# Altium project ScoreBoard_v.1.0.PrjPcb
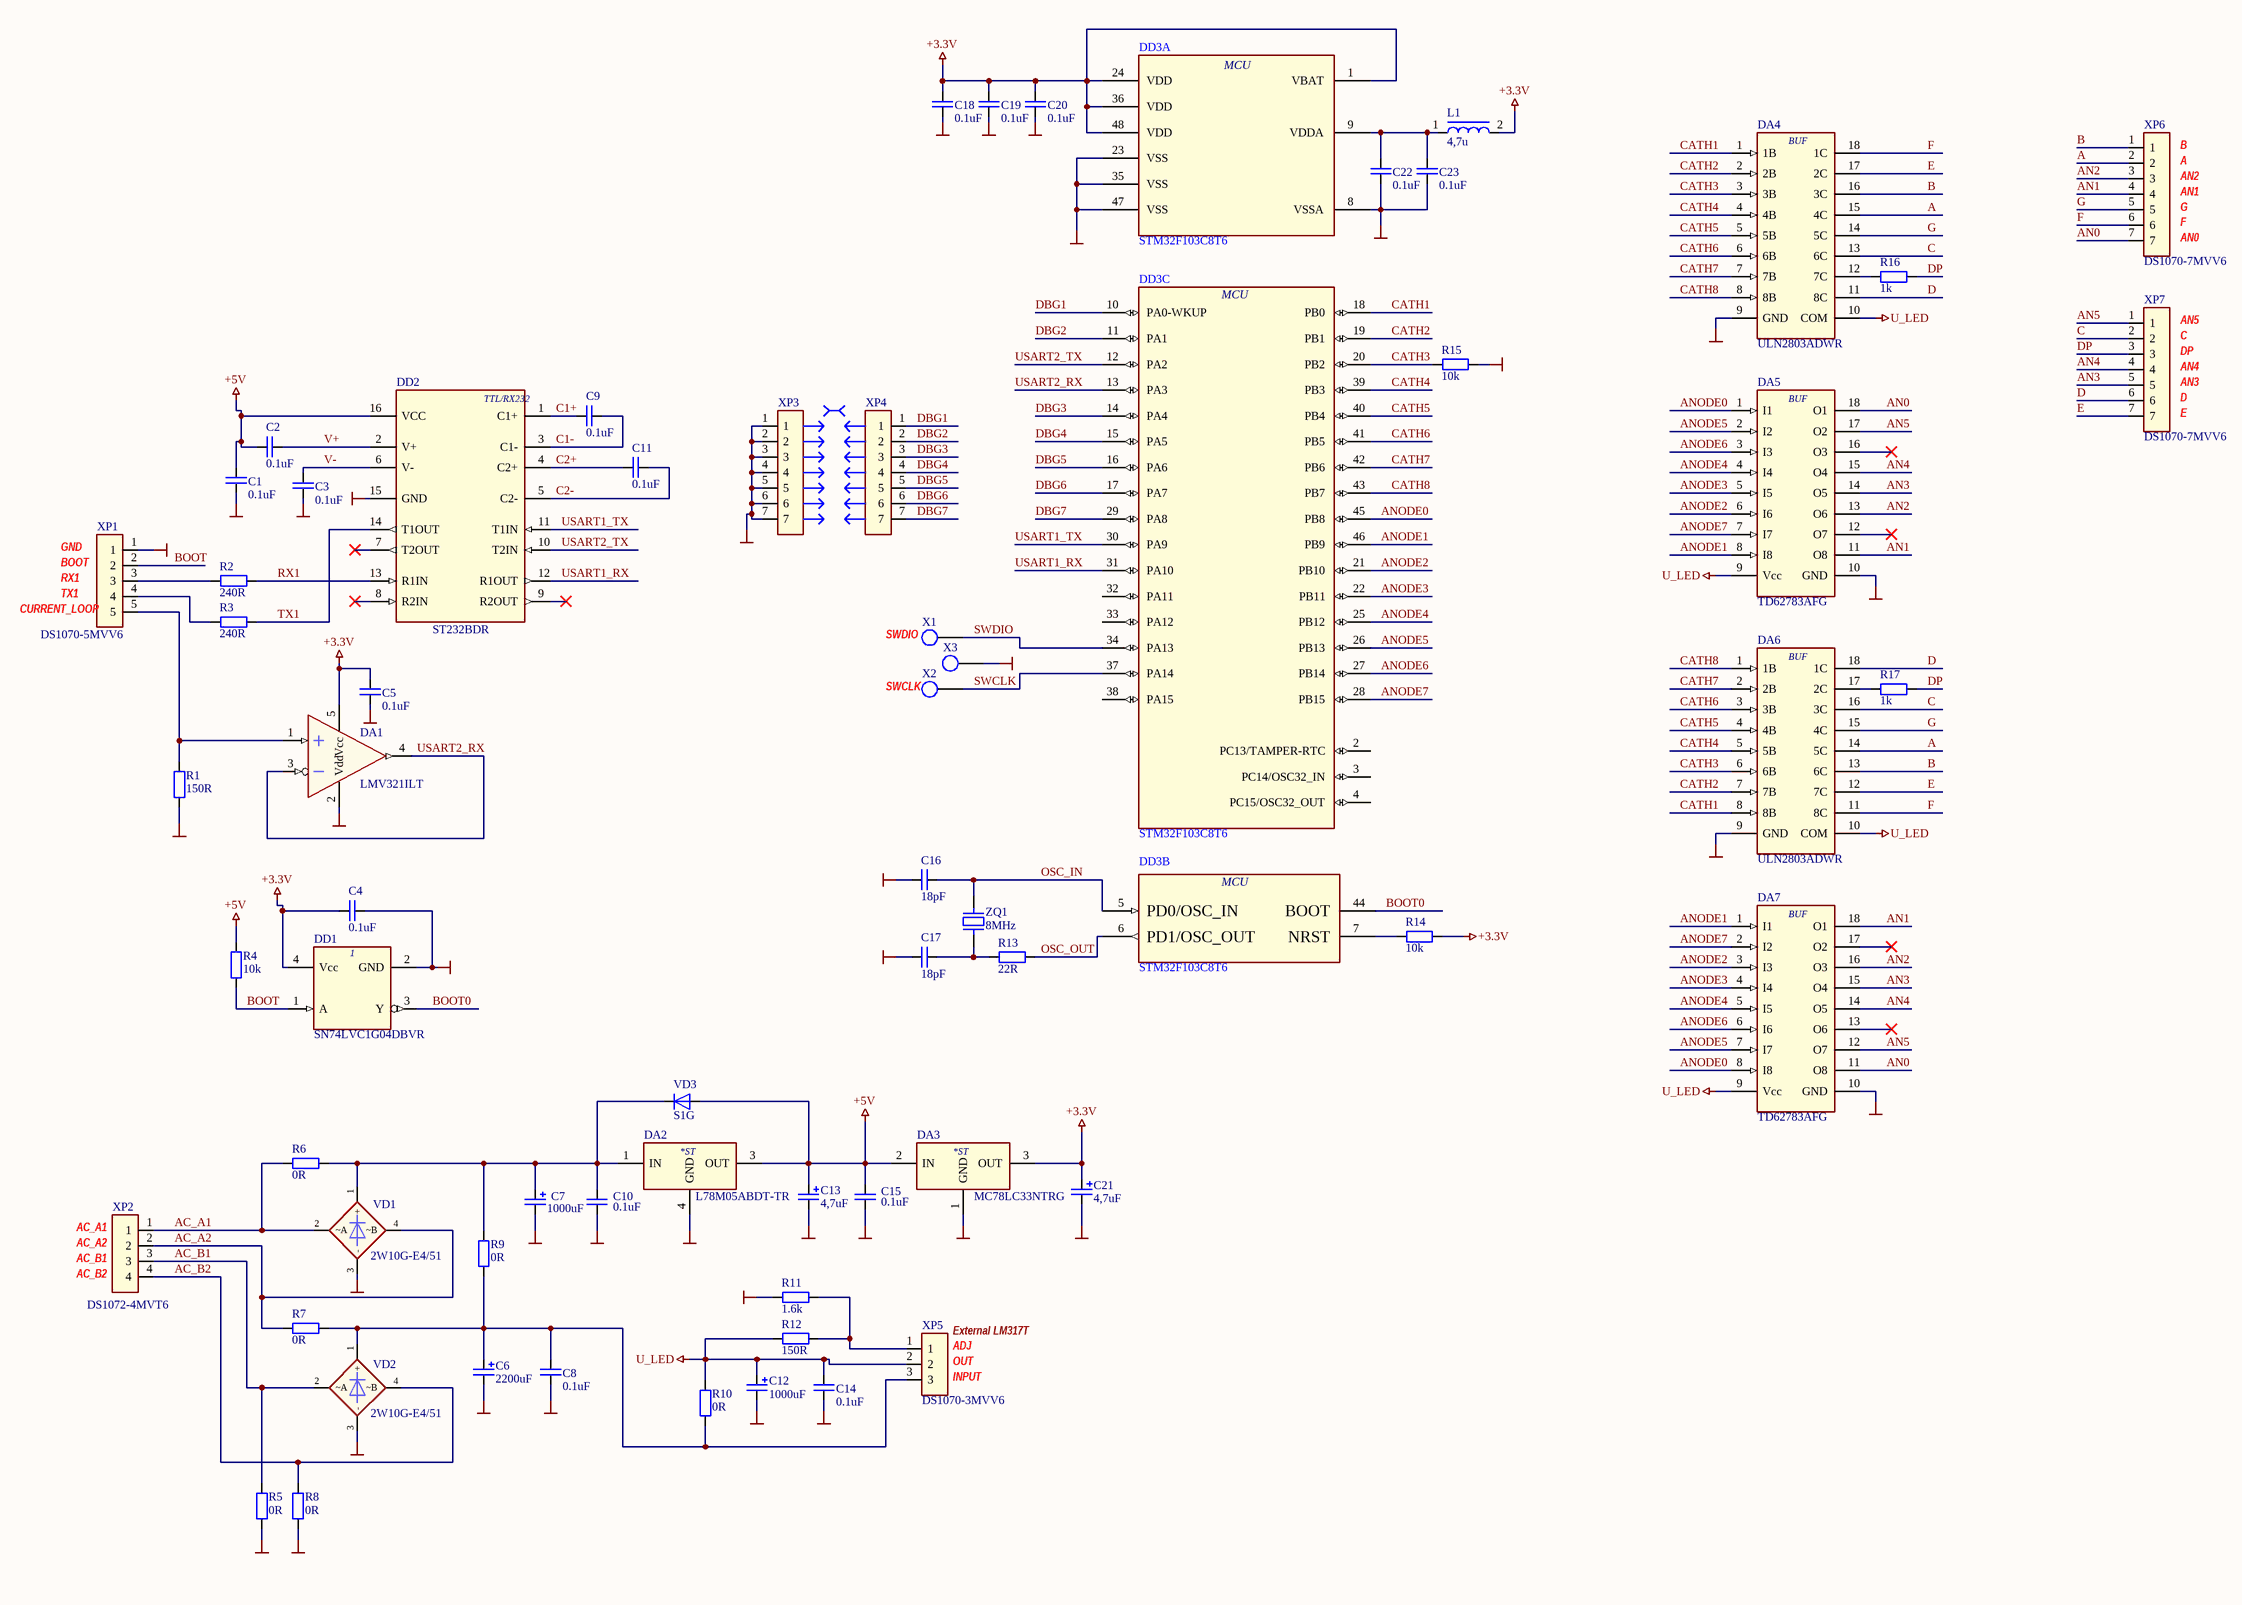
[diagram p0: SB_MAIN.SchDoc]
1 sheet, 65 parts. Net scope: global (net labels, ports and power ports of the same name join across sheets).

## Sheet SB_MAIN.SchDoc
size A2; SheetNumber: 1; SheetTotal: 1

### Parts
C1  0.1uF  [CAPC2012X14N]
C2  0.1uF  [CAPC2012X14N]
C3  0.1uF  [CAPC2012X14N]
C4  0.1uF  [CAPC2012X14N]
C5  0.1uF  [CAPC2012X14N]
C6  2200uF  [CAPR16X25]
C7  1000uF  [CAPR10x21]
C8  0.1uF  [JFA11x13x7.5]
C9  0.1uF  [CAPC2012X14N]
C10  0.1uF  [JFA11x13x7.5]
C11  0.1uF  [CAPC2012X14N]
C12  1000uF  [CAPR10x21]
C13  4,7uF  [CAPMP3217X18N]
C14  0.1uF  [JFA11x13x7.5]
C15  0.1uF  [JFA11x13x7.5]
C16  18pF  [CAPC2012X14N]
C17  18pF  [CAPC2012X14N]
C18  0.1uF  [CAPC2012X14N]
C19  0.1uF  [CAPC2012X14N]
C20  0.1uF  [CAPC2012X14N]
C21  4,7uF  [CAPMP3217X18N]
C22  0.1uF  [CAPC2012X14N]
C23  0.1uF  [CAPC2012X14N]
DA1  LMV321ILT  [SOT95P280X145-5N]
DA2  L78M05ABDT-TR  [DPAK228P1010X238-3N]
DA3  MC78LC33NTRG  [SOT89-150P350X160-3M]
DA4  ULN2803ADWR  [SOIC127P1030X265-18N]
DA5  TD62783AFG  [SOIC127P1020X245-18N]
DA6  ULN2803ADWR  [SOIC127P1030X265-18N]
DA7  TD62783AFG  [SOIC127P1020X245-18N]
DD1  SN74LVC1G04DBVR  [SOT95P280X145-5N]
DD2  ST232BDR  [SOIC127P600X175-16N]
DD3  STM32F103C8T6  [TSQFP50P900X900X160-48M]  (parts A,B,C of 3)
L1  4,7u  [INDC2012X10N]
R1  150R  [RESC2012X06N]
R2  240R  [RESC2012X06N]
R3  240R  [RESC2012X06N]
R4  10k  [RESC2012X06N]
R5  0R  [RESC6332X06N]
R6  0R  [RESC6332X06N]
R7  0R  [RESC6332X06N]
R8  0R  [RESC6332X06N]
R9  0R  [RESC6332X06N]
R10  0R  [RESC6332X06N]
R11  1.6k  [RESC2012X06N]
R12  150R  [RESC2012X06N]
R13  22R  [RESC2012X06N]
R14  10k  [RESC2012X06N]
R15  10k  [RESC2012X06N]
R16  1k  [RESC2012X06N]
R17  1k  [RESC2012X06N]
VD1  2W10G-E4/51  [DIOB_2W10]
VD2  2W10G-E4/51  [DIOB_2W10]
VD3  S1G  [DIOM4427X22M]
X1  0,9mm  [PAD_HOLE_0.9MM]  (value not drawn)  (no BOM)
X2  0,9mm  [PAD_HOLE_0.9MM]  (value not drawn)  (no BOM)
X3  0,9mm  [PAD_HOLE_0.9MM]  (value not drawn)  (no BOM)
XP1  DS1070-5MVV6  [CONNFLY_DS1070-5MVV6]
XP2  DS1072-4MVT6  [CONNFLY_DS1072-4MVT6]
XP3  L-KLS1-207-1-07-S  [KLS_KLS1-207-1-07-S]  (value not drawn)
XP4  L-KLS1-207-1-07-S  [KLS_KLS1-207-1-07-S]  (value not drawn)
XP5  DS1070-3MVV6  [CONNFLY_DS1070-3MVV6]
XP6  DS1070-7MVV6  [CONNFLY_DS1070-7MVV6]
XP7  DS1070-7MVV6  [CONNFLY_DS1070-7MVV6]
ZQ1  8MHz  [KX-3H_spacer]

### Nets
+3.3V: C4.1 C5.2 C18.2 C19.2 C20.2 C21.1(P) DA1.5(Vcc) DA3.3(OUT) DD1.4(Vcc) DD3.1(VBAT) DD3.24(VDD) DD3.36(VDD) DD3.48(VDD) L1.2 R14.2
+5V: C1.2 C2.1 C13.1(P) C15.2 DA2.3(OUT) DA3.2(IN) DD2.16(VCC) R4.2 VD3.2(A)
GND: C1.1 C3.2 C4.2 C5.1 C6.2(N) C7.2(N) C8.1 C10.1 C12.2(N) C13.2(N) C14.1 C15.1 C16.1 C17.1 C18.1 C19.1 C20.1 C21.2(N) C22.1 C23.1 DA1.2(Vdd) DA2.4(GND) DA3.1(GND) DA4.9(GND) DA5.10(GND) DA6.9(GND) DA7.10(GND) DD1.2(GND) DD2.15(GND) DD3.8(VSSA) DD3.23(VSS) DD3.35(VSS) DD3.47(VSS) R1.1 R5.1 R8.1 R11.1 R15.2 VD1.3(-) VD2.3(-) X3.1 XP1.1 XP3.1 XP3.2 XP3.3 XP3.4 XP3.5 XP3.6 XP3.7
U_LED: C12.1(P) C14.2 DA4.10(COM) DA5.9(Vcc) DA6.10(COM) DA7.9(Vcc) R10.2 R12.1 XP5.2
A: DA4.15(4C) DA6.14(5C) XP6.2
AC_A1: R6.1 VD1.2(~A) XP2.1
AC_A2: R7.1 VD1.4(~B) XP2.2
AC_B1: R5.2 VD2.2(~A) XP2.3
AC_B2: R8.2 VD2.4(~B) XP2.4
AN0: DA5.18(O1) DA7.11(O8) XP6.7
AN1: DA5.11(O8) DA7.18(O1) XP6.4
AN2: DA5.13(O6) DA7.16(O3) XP6.3
AN3: DA5.14(O5) DA7.15(O4) XP7.5
AN4: DA5.15(O4) DA7.14(O5) XP7.4
AN5: DA5.17(O2) DA7.12(O7) XP7.1
ANODE0: DA5.1(I1) DA7.8(I8) DD3.45(PB8)
ANODE1: DA5.8(I8) DA7.1(I1) DD3.46(PB9)
ANODE2: DA5.6(I6) DA7.3(I3) DD3.21(PB10)
ANODE3: DA5.5(I5) DA7.4(I4) DD3.22(PB11)
ANODE4: DA5.4(I4) DA7.5(I5) DD3.25(PB12)
ANODE5: DA5.2(I2) DA7.7(I7) DD3.26(PB13)
ANODE6: DA5.3(I3) DA7.6(I6) DD3.27(PB14)
ANODE7: DA5.7(I7) DA7.2(I2) DD3.28(PB15)
B: DA4.16(3C) DA6.13(6C) XP6.1
BOOT: DD1.1(A) R4.1 XP1.2
BOOT0: DD1.3(Y) DD3.44(BOOT)
C: DA4.13(6C) DA6.16(3C) XP7.2
C1+: C9.2 DD2.1(C1+)
C1-: C9.1 DD2.3(C1-)
C2+: C11.2 DD2.4(C2+)
C2-: C11.1 DD2.5(C2-)
CATH1: DA4.1(1B) DA6.8(8B) DD3.18(PB0)
CATH2: DA4.2(2B) DA6.7(7B) DD3.19(PB1)
CATH3: DA4.3(3B) DA6.6(6B) DD3.20(PB2) R15.1
CATH4: DA4.4(4B) DA6.5(5B) DD3.39(PB3)
CATH5: DA4.5(5B) DA6.4(4B) DD3.40(PB4)
CATH6: DA4.6(6B) DA6.3(3B) DD3.41(PB5)
CATH7: DA4.7(7B) DA6.2(2B) DD3.42(PB6)
CATH8: DA4.8(8B) DA6.1(1B) DD3.43(PB7)
D: DA4.11(8C) DA6.18(1C) XP7.6
DBG1: DD3.10(PA0-WKUP) XP4.1
DBG2: DD3.11(PA1) XP4.2
DBG3: DD3.14(PA4) XP4.3
DBG4: DD3.15(PA5) XP4.4
DBG5: DD3.16(PA6) XP4.5
DBG6: DD3.17(PA7) XP4.6
DBG7: DD3.29(PA8) XP4.7
DP: R16.2 R17.2 XP7.3
E: DA4.17(2C) DA6.12(7C) XP7.7
F: DA4.18(1C) DA6.11(8C) XP6.6
G: DA4.14(5C) DA6.15(4C) XP6.5
OSC_IN: C16.2 DD3.5(PD0/OSC_IN) ZQ1.2
OSC_OUT: DD3.6(PD1/OSC_OUT) R13.2
RX1: DD2.13(R1IN) R2.2
SWCLK: DD3.37(PA14) X2.1
SWDIO: DD3.34(PA13) X1.1
TX1: DD2.14(T1OUT) R3.2
USART1_RX: DD2.12(R1OUT) DD3.31(PA10)
USART1_TX: DD2.11(T1IN) DD3.30(PA9)
USART2_RX: DA1.3(-IN) DA1.4(OUT) DD3.13(PA3)
USART2_TX: DD2.10(T2IN) DD3.12(PA2)
V+: C2.2 DD2.2(V+)
V-: C3.1 DD2.6(V-)
NetC6_1: C6.1(P) C8.2 R7.2 R9.1 R10.1 VD2.1(+) XP5.3
NetC7_1: C7.1(P) C10.2 DA2.1(IN) R6.2 R9.2 VD1.1(+) VD3.1(K)
NetC17_2: C17.2 R13.1 ZQ1.1
NetC22_2: C22.2 C23.2 DD3.9(VDDA) L1.1
NetDA1_1: DA1.1(+IN) R1.2 XP1.5
NetDA4_12: DA4.12(7C) R16.1
NetDA6_17: DA6.17(2C) R17.1
NetDD3_7: DD3.7(NRST) R14.1
NetR2_1: R2.1 XP1.3
NetR3_1: R3.1 XP1.4
NetR11_2: R11.2 R12.2 XP5.1

Not connected (* = marked no-connect by the designer): DA5 12(O7)* 16(O3)*; DA7 13(O6)* 17(O2)*; DD2 7(T2OUT)* 8(R2IN)* 9(R2OUT)*; DD3 2(PC13/TAMPER-RTC) 3(PC14/OSC32_IN) 4(PC15/OSC32_OUT) 32(PA11) 33(PA12) 38(PA15)

### Notes on the sheet
- (near XP6) B
- (near XP6) A
- (near XP6) AN2
- (near XP6) AN1
- (near XP6) G
- (near XP6) F
- (near XP6) AN0
- (near XP7) AN5
- (near XP7) C
- (near XP7) DP
- (near XP7) AN4
- (near XP7) AN3
- (near XP7) D
- (near XP7) E
- (near XP1) GND
- (near XP1) CURRENT_LOOP
- (near XP1) BOOT
- (near XP1) RX1
- (near XP1) TX1
- (near X1) SWDIO
- (near X2) SWCLK
- (near XP2) AC_A1
- (near XP2) AC_A2
- (near XP2) AC_B1
- (near XP2) AC_B2
- (near XP5) External LM317T
- (near XP5) OUT
- (near XP5) INPUT
- (near XP5) ADJ
- (in symbol L78M05ABDT-TR[[/\]]IPC Medium) *ST
- (in symbol MC78LC33NTRG[[/\]]IPC Medium) *ST
- (in symbol ST232BDR[[/\]]IPC Medium) TTL/RX232
- (in symbol STM32F103C8T6[[/\]]IPC Medium, part A) MCU
- (in symbol STM32F103C8T6[[/\]]IPC Medium, part B) MCU
- (in symbol STM32F103C8T6[[/\]]IPC Medium, part C) MCU
- (in symbol TD62783AFG[[/\]]IPC Medium) BUF
- (in symbol ULN2803ADWR[[/\]]IPC Medium) BUF

### Library data of the parts
C1-C5 C9 C11 C18-C20 C22 C23 = GRM21BR71H104KA01L[[/\]]IPC Medium: Конденсатор 0805-X7R-50В-0,1мкФ ± 10%; Manufacturer: Murata Electronics; Type: Capacitor; Group: Capacitors; Dielectric type: X7R; Nominal Voltage: 50V; Manufacturer Part Number: GRM21BR71H104KA01L; Footprint Density: IPC Medium; Value: 0.1uF; Device Package: 0805; Tolerance: ± 10%; Max Operating Temperature: 125℃; Min Operating Temperature: -55℃
C6 = TKR222M1VK25[[/\]]IPC Medium: Конденсатор электролитический 35В-2200мкФ ± 20%; Manufacturer: Jamicon; Type: Capacitor; Group: Capacitors; Nominal Voltage: 35V; AEQ: No; Ripple Current: 1,6A; Manufacturer Part Number: TKR222M1VK25; Footprint Density: IPC Medium; Value: 2200uF; Device Package: Radial 16x25; Tolerance: ± 20%; Max Operating Temperature: 105℃; Min Operating Temperature: -55℃; RoHS: Yes
C7 C12 = WLR102M1EG21[[/\]]IPC Medium: Конденсатор электролитический 25В-1000мкФ ± 20%; Manufacturer: Jamicon; Type: Capacitor; Group: Capacitors; ESR: 40mOhm; Nominal Voltage: 25V; AEQ: No; Ripple Current: 2,27A; Manufacturer Part Number: WLR102M1EG21; Footprint Density: IPC Medium; Value: 1000uF; Device Package: Radial 10x21; Tolerance: ± 20%; Max Operating Temperature: 105℃; Min Operating Temperature: -55℃; RoHS: Yes
C8 C10 C14 C15 = JFA02A104J075000B[[/\]]IPC Medium: Конденсатор-100В-0,1мкФ ± 5%; Manufacturer: JB; Type: Film Capacitor; Group: Capacitors; Tolerance: ± 10%; ESR: 0,04Ohm; Nominal Voltage: 25V; AEQ: No; Manufacturer Part Number: JFA02A104J075000B; Footprint Density: IPC Medium; Value: 0.1uF; Device Package: Radial 10x21; Max Operating Temperature: 85℃; Min Operating Temperature: -40℃; ComponentLink1URL: https://www.jbcapacitors.com/news/jb-Stock-Offer-for-JFA-Mylar-Polyester-Film-Capacitors-20200227.html; ComponentLink1Description: Datasheet; RoHS: No
C13 C21 = TECAP4,7/10VA10[[/\]]IPC Medium: Конденсатор танталовый 10В-4,7мкФ ± 10%; Manufacturer: NoName; Type: Tantalum Capacitor; Group: Capacitors; Nominal Voltage: 10V; AEQ: No; Manufacturer Part Number: TECAP4,7/10VA10; Footprint Density: IPC Medium; Value: 4,7uF; Device Package: Type A; Tolerance: ± 10%; Max Operating Temperature: 85℃; Min Operating Temperature: -55℃; RoHS: Yes
C16 C17 = GRM2165C1H180JD01D[[/\]]IPC Medium: Конденсатор 0805-C0G-50В-18пФ ± 5%; Manufacturer: Murata Electronics; Type: Capacitor; Group: Capacitors; Dielectric type: C0G; Nominal Voltage: 50V; AEQ: AEC-Q200; Manufacturer Part Number: GRM2165C1H180JD01D; Footprint Density: IPC Medium; Value: 18pF; Device Package: 0805; Tolerance: ± 5%; Max Operating Temperature: 125℃; Min Operating Temperature: -55℃; RoHS: Yes
DA1 = LMV321ILT[[/\]]IPC Medium: Микросхема LMV321ILT; Manufacturer: STMicroelectronics; Group: Integrity circuits; Supply Voltage: 2,7-6V; Supply Current: 200uA; AEQ: No; Gain bandwidth: 1MHz; Input offset voltage: 0,1-3mV; CMRR: 55dB; Slew rate: 0,35V/us; Manufacturer Part Number: LMV321ILT; Footprint Density: IPC Medium; Type: Operational amplifier; Device Package: SOT23-5; Max Operating Temperature: 125℃; Min Operating Temperature: -40℃; RoHS: Yes
DA2 = L78M05ABDT-TR[[/\]]IPC Medium: Микросхема L78M05ABDT-TR; Manufacturer: STMicroelectronics; Group: Integrity circuits; Input Voltage: 35V; Output Voltage: 5V; AEQ: No; Output Current: 350mA; Dropout Voltage: 2V; Manufacturer Part Number: L78M05ABDT-TR; Footprint Density: IPC Medium; Type: Linear regulator; Device Package: DPAK; Max Operating Temperature: 125℃; Min Operating Temperature: -40℃; RoHS: Yes
DA3 = MC78LC33NTRG[[/\]]IPC Medium: Микросхема MC78LC33NTRG; Manufacturer: ON Semiconductor; Group: Integrity circuits; Input Voltage: 12V; Output Voltage: 3,3V; AEQ: No; Output Current: 50mA; Dropout Voltage: 1V; Manufacturer Part Number: MC78LC33NTRG; Footprint Density: IPC Medium; Type: Linear regulator; Device Package: SOT23-5; Max Operating Temperature: 85℃; Min Operating Temperature: -40℃; RoHS: Yes
DA4 DA6 = ULN2803ADWR[[/\]]IPC Medium: Микросхема ULN2803ADWR; Manufacturer: Texas Instruments; Group: Integrity circuits; Supply Voltage: 50V; Supply Current: 1,35mA; AEQ: No; Output Current: 300mA; Input Voltage: 3V; Manufacturer Part Number: ULN2803ADWR; Footprint Density: IPC Medium; Type: 8CH Darlington Transistor Arrays / Current Transistor Array; Device Package: SOIC-18; Max Operating Temperature: 85℃; Min Operating Temperature: -40℃; RoHS: Yes; Output Voltage: 50V
DA5 DA7 = TD62783AFG[[/\]]IPC Medium: Микросхема TD62783AFG; Manufacturer: Toshiba; Group: Integrity circuits; Supply Voltage: 50V; Supply Current: 2,5mA; AEQ: No; Output Current: -500mA; Input Voltage: 2V; Power Dissipation: 0,35W; Manufacturer Part Number: TD62783AFG; Footprint Density: IPC Medium; Type: 8CH HIGH−VOLTAGE SOURCE DRIVER / Current Transistor Array; Device Package: SOP-18; Max Operating Temperature: 85℃; Min Operating Temperature: -40℃; RoHS: Yes; Output Voltage: 50V
DD1 = SN74LVC1G04DBVR[[/\]]IPC Medium: Микросхема SN74LVC1G04DBVR; Manufacturer: Texas Instruments; Group: Integrity circuits; Supply Voltage: 5,5V; Supply Current: 10uA; AEQ: No; Manufacturer Part Number: SN74LVC1G04DBVR; Footprint Density: IPC Medium; Type: Single inverter gate; Device Package: SOT23-5; Max Operating Temperature: 85℃; Min Operating Temperature: -40℃; RoHS: Yes
DD2 = ST232BDR[[/\]]IPC Medium: Микросхема ST232BDR; Manufacturer: STMicroelectronics; Group: Integrity circuits; Supply Voltage: 5,5V; Supply no Load Current: 10mA; AEQ: No; Input Voltage: ± 30V; Output Voltage: ± 7.8V; Date rate: 220 kbits/s; Manufacturer Part Number: ST232BDR; Footprint Density: IPC Medium; Type: RS232 Transmitter; Device Package: SO-16; Max Operating Temperature: 85℃; Min Operating Temperature: -40℃; RoHS: Yes
DD3 = STM32F103C8T6[[/\]]IPC Medium: Микросхема STM32F103C8T6; Manufacturer: STMicroelectronics; Group: Integrity circuits; Supply Voltage: 3,3V; Supply Current: 35mA; AEQ: No; Manufacturer Part Number: STM32F103C8T6; Footprint Density: IPC Medium; Type: Microcontroller; Device Package: LQFP48; Max Operating Temperature: 85℃; Min Operating Temperature: -40℃; RoHS: Yes
L1 = LQM21PN4R7NGR[[/\]]IPC Medium: Индуктивность 0805-4,7мкГ ± 30%; Manufacturer: Murata Electronics; Group: Inductors; AEQ: No; DC Resistance: 0,23mOhm; SRfreq: 30MHz; Rated current 85C: 0,8A; Manufacturer Part Number: LQM21PN4R7NGR; Footprint Density: IPC Medium; Value: 4,7u; Type: Inductor; Device Package: 0805; Tolerance: ± 30%; Max Operating Temperature: 125℃; Min Operating Temperature: -55℃; RoHS: Yes
R1 R12 = RC0805FR-07150RL[[/\]]IPC Medium: Резистор 0805-0,125Вт-150Ом ± 1%; Manufacturer: Yageo; Group: Resistors; Power (Watts): 0,125W; Nominal Voltage: 150V; Max Voltage: 300V; AEQ: No; Manufacturer Part Number: RC0805FR-07150RL; Footprint Density: IPC Medium; Value: 150R; Type: Resistor; Device Package: 0805; Tolerance: ± 1%; Max Operating Temperature: 155℃; Min Operating Temperature: -55℃; RoHS: Yes
R2 R3 = RC0805FR-07240RL[[/\]]IPC Medium: Резистор 0805-0,125Вт-240Ом ± 1%; Manufacturer: Yageo; Group: Resistors; Power (Watts): 0,125W; Nominal Voltage: 150V; Max Voltage: 300V; AEQ: No; Manufacturer Part Number: RC0805FR-07240RL; Footprint Density: IPC Medium; Value: 240R; Type: Resistor; Device Package: 0805; Tolerance: ± 1%; Max Operating Temperature: 155℃; Min Operating Temperature: -55℃; RoHS: Yes
R4 R14 R15 = RC0805FR-0710KL[[/\]]IPC Medium: Резистор 0805-0,125Вт-10кОм ± 1%; Manufacturer: Yageo; Group: Resistors; Power (Watts): 0,125W; Nominal Voltage: 150V; Max Voltage: 300V; AEQ: No; Manufacturer Part Number: RC0805FR-0710KL; Footprint Density: IPC Medium; Value: 10k; Type: Resistor; Device Package: 0805; Tolerance: ± 1%; Max Operating Temperature: 155℃; Min Operating Temperature: -55℃; RoHS: Yes
R5-R10 = RC2512FR-070RL[[/\]]IPC Medium: Резистор 2512-1Вт-0Ом ± 1%; Manufacturer: Yageo; Group: Resistors; Power (Watts): 1W - 4A; Nominal Voltage: 250V; Max Voltage: 500V; AEQ: No; Manufacturer Part Number: RC2512FR-070RL; Footprint Density: IPC Medium; Value: 0R; Type: Resistor; Device Package: 0805; Tolerance: ± 1%; Max Operating Temperature: 155℃; Min Operating Temperature: -55℃; RoHS: Yes
R11 = RC0805FR-071K6L[[/\]]IPC Medium: Резистор 0805-0,125Вт-1,6кОм ± 1%; Manufacturer: Yageo; Group: Resistors; Power (Watts): 0,125W; Nominal Voltage: 150V; Max Voltage: 300V; AEQ: No; Manufacturer Part Number: RC0805FR-071K6L; Footprint Density: IPC Medium; Value: 1.6k; Type: Resistor; Device Package: 0805; Tolerance: ± 1%; Max Operating Temperature: 155℃; Min Operating Temperature: -55℃; RoHS: Yes
R13 = RC0805JR-0722RL[[/\]]IPC Medium: Резистор 0805-0,125Вт-22Ом ± 5%; Manufacturer: Yageo; Group: Resistors; Power (Watts): 0,125W; Nominal Voltage: 150V; Max Voltage: 300V; AEQ: No; Manufacturer Part Number: RC0805JR-0722RL; Footprint Density: IPC Medium; Value: 22R; Type: Resistor; Device Package: 0805; Tolerance: ± 5%; Max Operating Temperature: 155℃; Min Operating Temperature: -55℃; RoHS: Yes
R16 R17 = RC1206FR-071KL[[/\]]IPC High: Резистор 1206-0,25Вт-1кОм ± 1%; Manufacturer: Yageo; Group: Resistors; Power (Watts): 0,25W; Nominal Voltage: 200V; Max Voltage: 400V; AEQ: No; Manufacturer Part Number: RC1206FR-071KL; Footprint Density: IPC High; Value: 1k; Type: Resistor; Device Package: 0805; Tolerance: ± 1%; Max Operating Temperature: 155℃; Min Operating Temperature: -55℃; RoHS: Yes
VD1 VD2 = 2W10G-E4/51[[/\]]IPC Medium: Диод 2W10G-E4/51; Manufacturer: Vishay; Type: Bridge Rectifiers / Current Transistor Array; Group: Diods; Revers Voltage: 1000V; Average Current: 2A; AEQ: No; Impuls current: 60A; Forward Voltage: 1,1V; Manufacturer Part Number: 2W10G-E4/51; Footprint Density: IPC Medium; Device Package: 2W10; Max Operating Temperature: 150℃; Min Operating Temperature: -55℃; RoHS: Yes
VD3 = S1G[[/\]]IPC Medium: Диод S1G; Manufacturer: Diotec Semiconductor; Type: Rectifier Diod; Group: Diods; Revers Voltage: 320V; Average Current: 1A; AEQ: No; Impuls current: 30A; Forward Voltage: 1,1V; Manufacturer Part Number: S1G; Footprint Density: IPC Medium; Device Package: SMA / DO-214AC; Max Operating Temperature: 150℃; Min Operating Temperature: -50℃; RoHS: Yes
X1-X3 = PAD_1.8_HOLE_0.9MM[[/\]]IPC Medium: Manufacturer: NO BOM; Manufacturer Part Number: PAD_1.8_HOLE_0.9MM; Footprint Density: IPC Medium; Type: HOLE 0,9MM; Diametr: 0,9mm
XP1 = DS1070-5MVV6[[/\]]IPC Medium: Соединитель DS1070-5MVV6; Manufacturer: Connfly; Pins number: 5; Group: Connectors; Row Number: 1; Nominal current: 3A; AEQ: No; Nominal Voltage: 250V; Manufacturer Part Number: DS1070-5MVV6; Footprint Density: IPC Medium; Type: Connector; Max Operating Temperature: 85℃; Min Operating Temperature: -25℃; RoHS: Yes
XP2 = DS1072-4MVT6[[/\]]IPC Medium: Соединитель DS1072-4MVT6; Manufacturer: Connfly; Pins number: 4; Group: Connectors; Row Number: 1; Nominal current: 3A; AEQ: No; Nominal Voltage: 250V; Manufacturer Part Number: DS1072-4MVT6; Footprint Density: IPC Medium; Type: Connector; Max Operating Temperature: 85℃; Min Operating Temperature: -25℃; RoHS: Yes
XP3 XP4 = L-KLS1-207-1-07-S[[/\]]IPC Medium: Соединитель DS1072-4MVT6; Manufacturer: KLS; Pins number: 7; Group: Connectors; Row Number: 1; Nominal current: 3A; AEQ: No; Nominal Voltage: 250V; Manufacturer Part Number: L-KLS1-207-1-07-S; Footprint Density: IPC Medium; Type: Connector; Max Operating Temperature: 105℃; Min Operating Temperature: -40℃; RoHS: Yes
XP5 = DS1070-3MVV6[[/\]]IPC Medium: Соединитель DS1070-3MVV6; Manufacturer: Connfly; Pins number: 3; Group: Connectors; Row Number: 1; Nominal current: 3A; AEQ: No; Nominal Voltage: 250V; Manufacturer Part Number: DS1070-3MVV6; Footprint Density: IPC Medium; Type: Connector; Max Operating Temperature: 85℃; Min Operating Temperature: -25℃; RoHS: Yes
XP6 XP7 = DS1070-7MVV6[[/\]]IPC Medium: Соединитель DS1070-7MVV6; Manufacturer: Connfly; Pins number: 7; Group: Connectors; Row Number: 1; Nominal current: 3A; AEQ: No; Nominal Voltage: 250V; Manufacturer Part Number: DS1070-7MVV6; Footprint Density: IPC Medium; Type: Connector; Max Operating Temperature: 85℃; Min Operating Temperature: -25℃; RoHS: Yes
ZQ1 = HC-49US-8MHz-16pF-30ppm[[/\]]IPC Medium: Кварцевый резонатор HC-49US-8MHz-16pF-30ppm; Manufacturer: NoName; Group: Quartz; Tolerance: 30ppm; AEQ: No; Load Capacity: 16pF; ESR: 80Ohm; Manufacturer Part Number: HC-49US-8MHz-16pF-30ppm; Footprint Density: IPC Medium; Frequency: 8MHz; Type: Quartz Resonator; Max Operating Temperature: 70℃; Min Operating Temperature: -20℃; RoHS: No